# Altium schematic sheet 74FCT3807S_PINOUT.SchDoc
size A; SheetNumber: 6; SheetTotal: 12
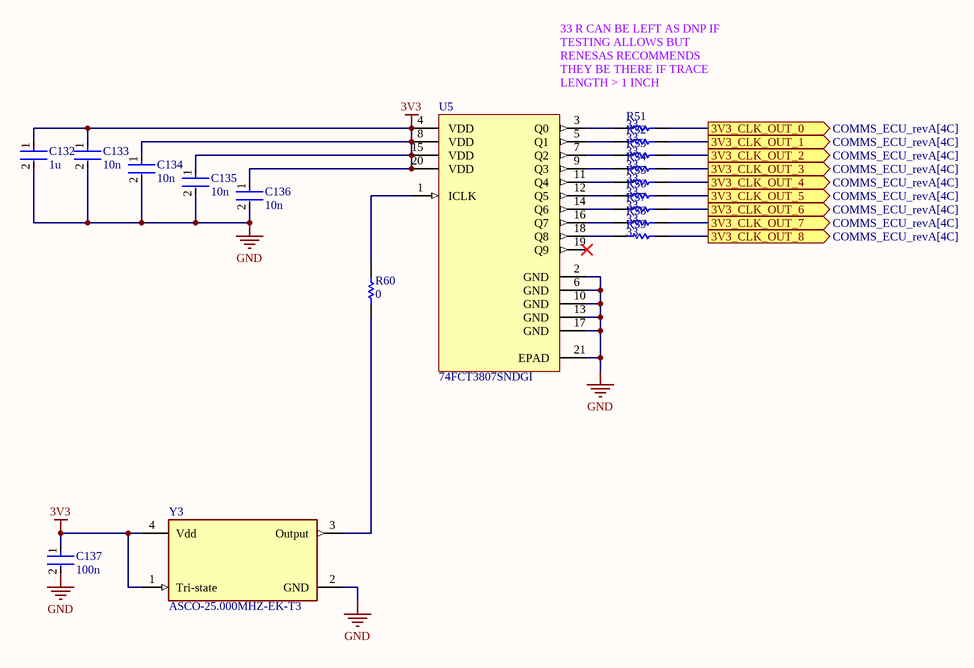
[diagram p0: 74FCT3807S_PINOUT.SchDoc]

## Parts
C132  1u  [FP-0402-L_1_0_0_05-W_0_5-IPC_A]
C133  10n  [FP-0402-L_1_0_0_05-W_0_5-IPC_A]
C134  10n  [FP-0402-L_1_0_0_05-W_0_5-IPC_A]
C135  10n  [FP-0402-L_1_0_0_05-W_0_5-IPC_A]
C136  10n  [FP-0402-L_1_0_0_05-W_0_5-IPC_A]
C137  100n  [FP-0402-L_1_0_0_05-W_0_5-IPC_A]
R51  33  [RESC1005X40X25ML05T05]
R52  33  [RESC1005X40X25ML05T05]
R53  33  [RESC1005X40X25ML05T05]
R54  33  [RESC1005X40X25ML05T05]
R55  33  [RESC1005X40X25ML05T05]
R56  33  [RESC1005X40X25ML05T05]
R57  33  [RESC1005X40X25ML05T05]
R58  33  [RESC1005X40X25ML05T05]
R59  33  [RESC1005X40X25ML05T05]
R60  0  [RESC1005X40X25ML05T05]
U5  74FCT3807SNDGI  [NDG20S2_MFG]
Y3  ASCO-25.000MHZ-EK-T3  [FP-ASCO-MFG]

## Ports
3V3_CLK_OUT_0 (out, see COMMS_ECU_revA[4C]), 3V3_CLK_OUT_1 (out, see COMMS_ECU_revA[4C]), 3V3_CLK_OUT_2 (out, see COMMS_ECU_revA[4C]), 3V3_CLK_OUT_3 (out, see COMMS_ECU_revA[4C]), 3V3_CLK_OUT_4 (out, see COMMS_ECU_revA[4C]), 3V3_CLK_OUT_5 (out, see COMMS_ECU_revA[4C]), 3V3_CLK_OUT_6 (out, see COMMS_ECU_revA[4C]), 3V3_CLK_OUT_7 (out, see COMMS_ECU_revA[4C]), 3V3_CLK_OUT_8 (out, see COMMS_ECU_revA[4C])

## Nets
3V3: C132.1 C133.1 C134.1 C135.1 C136.1 C137.1 U5.4(VDD) U5.8(VDD) U5.15(VDD) U5.20(VDD) Y3.1(Tri-state) Y3.4(Vdd)
GND: C132.2 C133.2 C134.2 C135.2 C136.2 C137.2 U5.2(GND) U5.6(GND) U5.10(GND) U5.13(GND) U5.17(GND) U5.21(EPAD) Y3.2(GND)
3V3_CLK_OUT_0: R51.2 ; port 3V3_CLK_OUT_0
3V3_CLK_OUT_1: R52.2 ; port 3V3_CLK_OUT_1
3V3_CLK_OUT_2: R53.2 ; port 3V3_CLK_OUT_2
3V3_CLK_OUT_3: R54.2 ; port 3V3_CLK_OUT_3
3V3_CLK_OUT_4: R55.2 ; port 3V3_CLK_OUT_4
3V3_CLK_OUT_5: R56.2 ; port 3V3_CLK_OUT_5
3V3_CLK_OUT_6: R57.2 ; port 3V3_CLK_OUT_6
3V3_CLK_OUT_7: R58.2 ; port 3V3_CLK_OUT_7
3V3_CLK_OUT_8: R59.2 ; port 3V3_CLK_OUT_8
NetR51_1: R51.1 U5.3(Q0)
NetR52_1: R52.1 U5.5(Q1)
NetR53_1: R53.1 U5.7(Q2)
NetR54_1: R54.1 U5.9(Q3)
NetR55_1: R55.1 U5.11(Q4)
NetR56_1: R56.1 U5.12(Q5)
NetR57_1: R57.1 U5.14(Q6)
NetR58_1: R58.1 U5.16(Q7)
NetR59_1: R59.1 U5.18(Q8)
NetR60_1: R60.1 Y3.3(Output)
NetR60_2: R60.2 U5.1(ICLK)

Not connected (* = marked no-connect by the designer): U5 19(Q9)*

## Notes on the sheet
- 33 R CAN BE LEFT AS DNP IF TESTING ALLOWS BUT RENESAS RECOMMENDS THEY BE THERE IF TRACE LENGTH > 1 INCH

## Library data of the parts
C132-C137 = CMP-001-00058-1: LARGE PADS, 0402 CAP, CHANGE COMMENT TO MATCH REAL P/N; Capacitor Type: Ceramic; Min Operating Temperature: -55°C; Mounting Technology: Surface Mount; Pins: 2; Case/Package: 0402; RoHS Compliant: Yes; Max Operating Temperature: 85°C
R51-R60 = CMP-009-00118-2: READ THE NAME; Pins: 2; Component Type: Standard; Design Item ID: CMP-009-00206-2; Source: 0402jump.SchLib
  R51-R59: Value: 33
  R60: Value: 0
U5 = CMP-00572-106914266-1: Clock Fanout Buffer (Distribution) IC 110 200 MHz 20-VFQFN Exposed Pad; Manufacturer Lifecycle Status: ACTIVE; Min Supply Voltage: 1.71V; Max Supply Voltage: 3.465V; Pitch: 400µm; Max Output Frequency: 200MHz; HelpURL: https://octopart.com/cad-content/api/get-model-datasheet/15189/106914266; Number of Pins: 20; ComponentLink1Description: Manufacturer's Website; Min Operating Temperature: -40°C; Max Operating Temperature: 105°C; MSL: 1; ComponentLink3Description: Manufacturer's Package Drawing; Lifecycle Status: Production; Harmonized Tariff Schedule (HTS) Code: 8540000000; ComponentLink2Description: Datasheet URL; RoHS: Compliant; ComponentLink3URL: https://www.renesas.com/en/document/psc/20-vfqfpn-package-outline-drawing-30-x-30-x-090-mm-040mm-pitch-165-x-165-mm-epad-wettable-flank; Mount: Surface Mount; Width: 3mm; Contact Plating: Tin; Package Quantity: 0; Height: 1mm; ComponentLink1URL: http://www.renesas.com; ComponentLink2URL: https://octopart.com/cad-content/api/get-model-datasheet/15189/106914266; Export Control Classification Number (ECCN) Code: NLR; Lead Free: Lead Free; Thickness: 1mm; Part Family: 74FCT3807S; Length: 3mm
Y3 = CMP-27762-011440-1: XTAL OSC XO 25.0000MHZ CMOS SMD; Min Supply Voltage: 2.97V; Frequency: 25MHz; Max Supply Voltage: 3.63V; Max Supply Current: 6mA; Load Capacitance: 15pF; Frequency Stability: 30ppm; Operating Supply Voltage: 3.3V; Termination: SMD/SMT; Length: 0.063inch; Min Operating Temperature: -20°C; Height: 0.028inch; Number of Pins: 4; Case/Package: SMD/SMT; Packaging: Tape and Reel; Max Operating Temperature: 70°C; Package Quantity: 3000; Mount: Surface Mount; Width: 0.047inch